# EAGLE design homie-wemos (EAGLE 7.5.0)
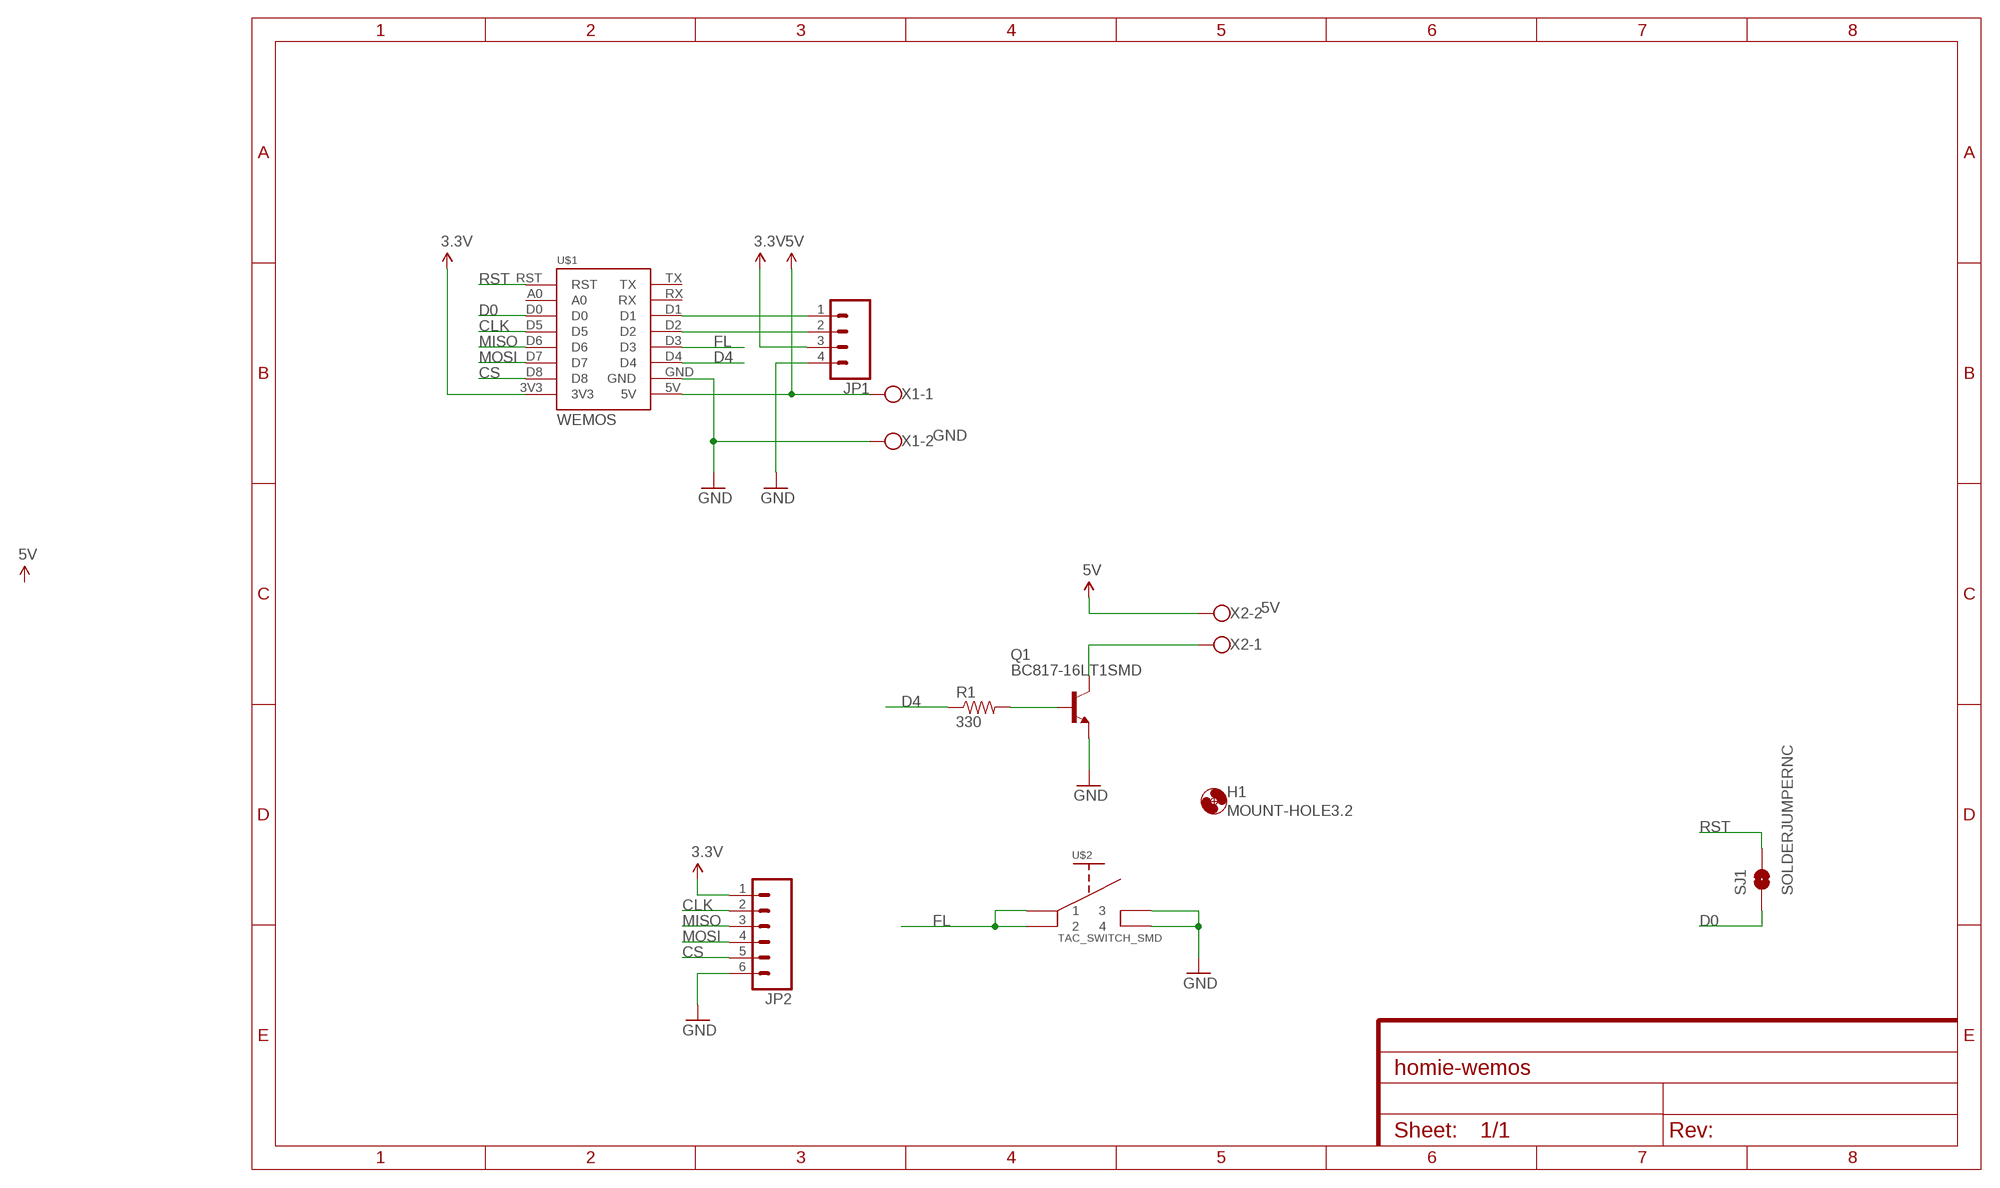
[diagram p0: schematic, sheet 1]

## Parts
H1  MOUNT-HOLE3.2  [3,2]
JP1  M04LOCK_LONGPADS  [1X04_LOCK_LONGPADS]
JP2  M06LOCK_LONGPADS  [1X06_LOCK_LONGPADS]
Q1  BC817-16LT1SMD  [SOT23-BEC]
R1  330  RESISTOR0603-RES  [0603-RES]
SJ1  SOLDERJUMPERNC  [SJ_2S]
U$1  WEMOS  [WEMOS]
U$2  TS-017A  [TS-017ASMD]
X1  W237-102  [W237-102]
X2  W237-102  [W237-102]

## Nets
3.3V: JP1.3 JP2.1 U$1.3V3
5V: U$1.5V X1.1 X2.2
CLK: JP2.2 U$1.D5
CS: JP2.5 U$1.D8
D0: SJ1.1 U$1.D0
D4: R1.1 U$1.D4
FL: U$1.D3 U$2.P$1 U$2.P$2
GND: JP1.4 JP2.6 Q1.E U$1.GND U$2.P$3 U$2.P$4 X1.2
MISO: JP2.3 U$1.D6
MOSI: JP2.4 U$1.D7
N$2: JP1.1 U$1.D1
N$3: JP1.2 U$1.D2
N$4: Q1.C X2.1
N$5: Q1.B R1.2
RST: SJ1.2 U$1.RST
Unconnected: U$1.A0 U$1.RX U$1.TX

## Notes on the sheet
- GND
- 5V

## Library data of the parts
H1 = holes:MOUNT-HOLE: MOUNTING HOLE with drill center marker
JP1 = SparkFun-Connectors:M04: Header 4 Standard 4-pin 0.1" header. Use with straight break away headers (SKU : PRT-00116), right angle break away headers (PRT-00553), swiss pins (PRT-00743), machine pins (PRT-00117), and female headers (PRT-00115). Molex polarized connector foot print use with SKU : PRT-08231 with associated crimp pins and housings. 1MM SMD Version SKU: PRT-10208
JP2 = SparkFun-Connectors:M06: Header 6 Standard 6-pin 0.1" header. Use with straight break away headers (SKU : PRT-00116), right angle break away headers (PRT-00553), swiss pins (PRT-00743), machine pins (PRT-00117), and female headers (PRT-00115). Molex polarized connector foot print use with SKU : PRT-08094 with associated crimp pins and housings. NOTES ON THE VARIANTS LOCK and LOCK_LONGPADS... This footprint was designed to help hold the alignment of a through-hole component (i.e. 6-pin header) while soldering it into place. You may notice that each hole has been shifted either up or down by 0.005 of an inch from it's more standard position (which is a perfectly straight line). This slight alteration caused the pins (the squares in the middle) to touch the edges of the holes. Because they are alternating, it causes a "brace" to hold the component in place. 0.005 has proven to be the perfect amount of "off-center" position when using our standard breakaway headers. Although looks a little odd when you look at the bare footprint, once you have a header in there, the alteration is very hard to notice. Also,if you push a header all the way into place, it is covered up entirely on the bottom side. This idea of altering the position of holes to aid alignment will be further integrated into the Sparkfun Library for other footprints. It can help hold any component with 3 or more connection pins.
Q1 = transistor-npn:BC817*: NPN Transistor
R1 = SparkFun-Passives:RESISTOR: Resistor Basic schematic elements and footprints for 0603, 1206, and PTH resistors.
SJ1 = SparkFun-Retired:SOLDERJUMPER: Solder Jumper Standard SMD solder jumper. Used to automate production. Two varients : Normally Open and Normally Closed are the same, but have different paste layers. NC will have a large amount of paste and should jumper during reflow.
U$1 = 1455413453956-wemos:WEMOS
U$2 = aliexpress-ts-017a:TS-017A
X1 X2 = con-wago-500:W237-102: WAGO SCREW CLAMP; MPN: 237-102; OC_FARNELL: unknown; OC_NEWARK: 70K9898

## Board
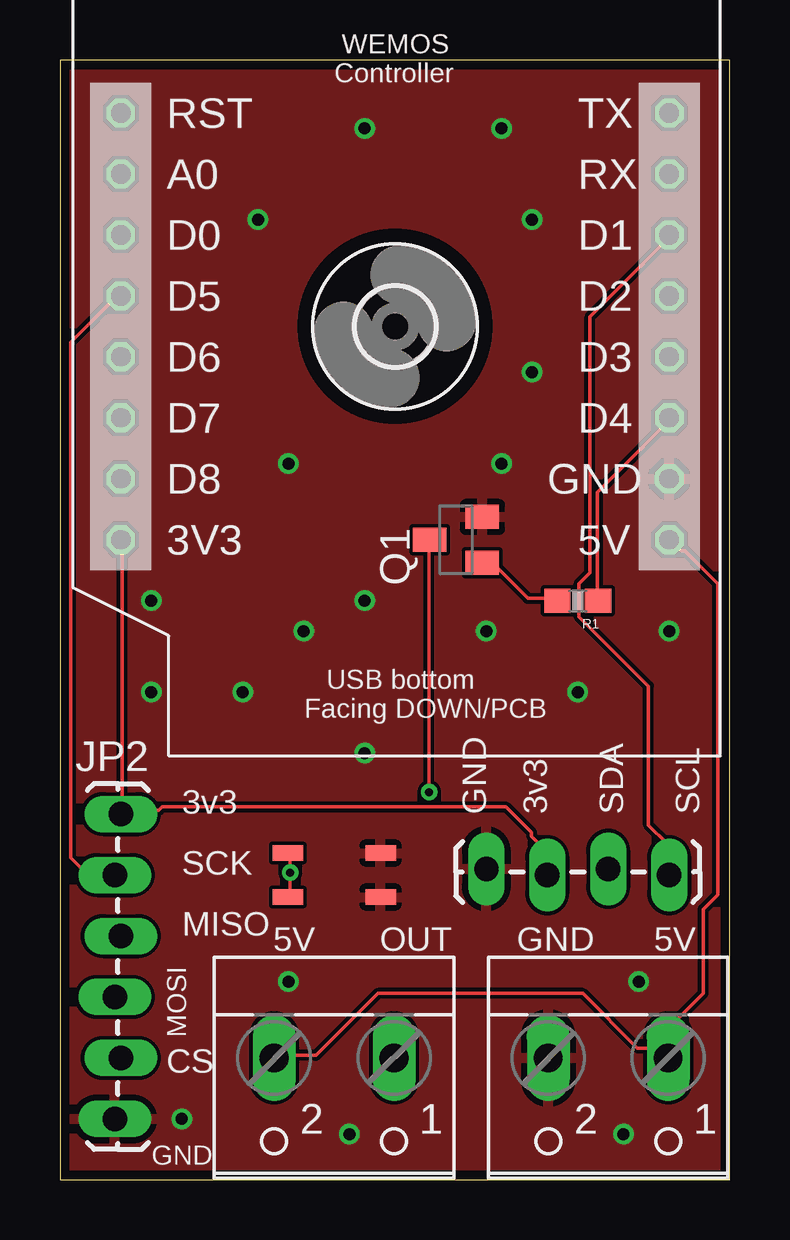
[diagram p1: board, top side]
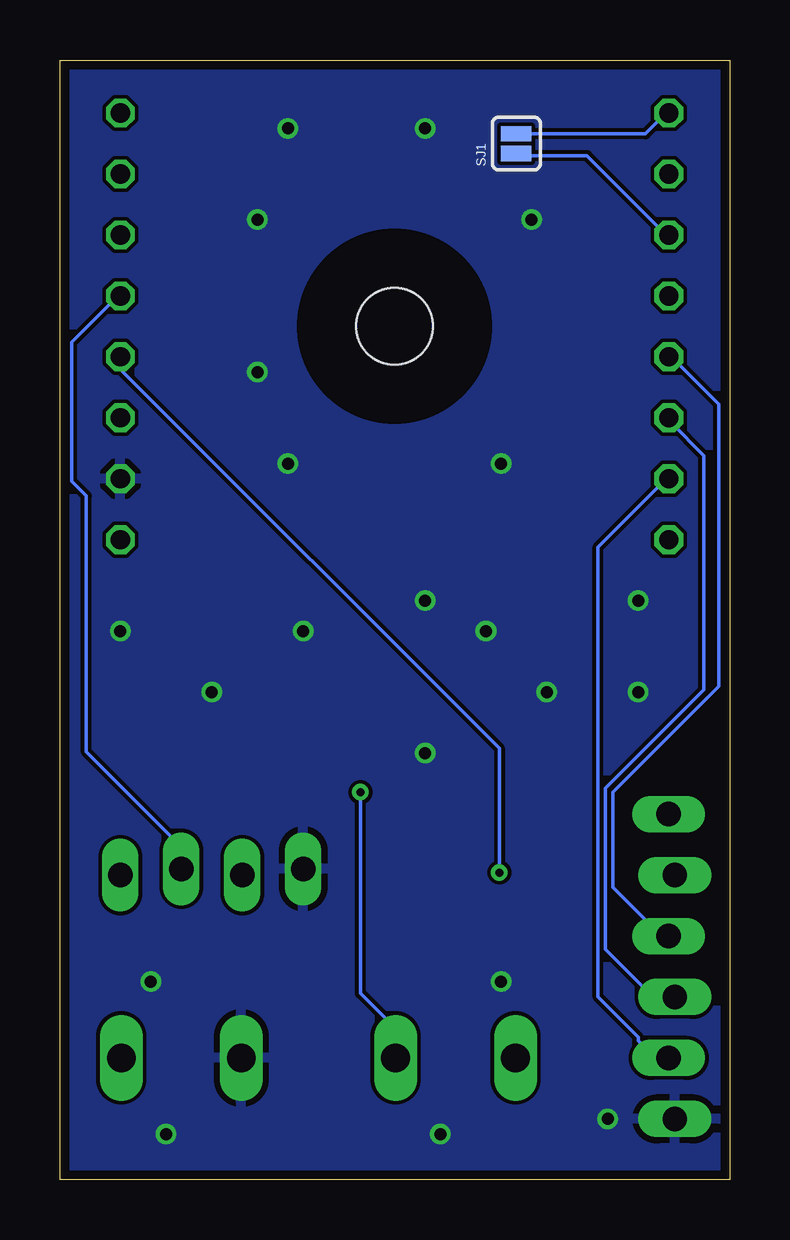
[diagram p2: board, bottom side, seen from below]

Size 27.92 x 46.66 mm. Coordinates in mm from the lower left corner, seen from the top.
Outline: 0,0 27.92,0 27.92,46.66 0,46.66 0,0
Copper layers (1*16): Top 0.0356mm / dielectric 1.5011mm / Bottom 0.0356mm
Design rules "OSHPark_LaenPCBOrder": minimum track width 6mil, minimum drill 13mil, track to track 6mil, track to pad 6mil, pad to pad 6mil, via to via 6mil, smd to smd 6mil, copper to edge 15mil, drill to drill 6mil, minimum pad ring 7mil, minimum via ring 7mil, stop-mask expansion 3mil, vias tented up to drill 0mil, thermal gap 10mil

### Footprints (pad centres in the part's own frame; a part is rotated, then mirrored left to right if it is on the bottom)
3,2 = hole 3.2: 0,0
1X04_LOCK_LONGPADS = drill 1.016 long: 1 0,0; 2 2.54,-0.254; 3 5.08,0; 4 7.62,-0.254
1X06_LOCK_LONGPADS = drill 1.016 long: 1 0,0; 2 2.54,-0.254; 3 5.08,0; 4 7.62,-0.254; 5 10.16,0; 6 12.7,-0.254
SOT23-BEC = smd 1 x 1.4: B -0.95,-1.1; C 0,1.1; E 0.95,-1.1
0603-RES = smd 1.1 x 1: 1 -0.85,0; 2 0.85,0
SJ_2S = smd 0.635 x 1.27: 1 -0.412,0; 2 0.412,0
WEMOS = drill 0.8 octagon: 3V3 0,0; 5V 22.86,0; A0 0,15.24; D0 0,12.7; D1 22.86,12.7; D2 22.86,10.16; D3 22.86,7.62; D4 22.86,5.08; D5 0,10.16; D6 0,7.62; D7 0,5.08; D8 0,2.54; GND 22.86,2.54; RST 0,17.78; RX 22.86,15.24; TX 22.86,17.78
TS-017ASMD = smd 1.27 x 0.635: P$1 -1.935,0.917; P$2 -1.935,-0.917; P$3 1.935,0.917; P$4 1.935,-0.917
W237-102 = drill 1.194 long: 1 -2.5,-1.27; 2 2.5,-1.27

### Placement (x,y rotation side)
H1  13.97,35.56 0 top
JP1  25.4,12.7 180 top
JP2  2.54,15.24 270 top
Q1  16.51,26.67 90 top
R1  21.59,24.13 180 top
SJ1  8.89,43.18 90 bottom
U$1  2.54,26.67 0 top
U$2  11.43,12.7 0 top
X1  22.86,3.81 180 top
X2  11.43,3.81 180 top

### Tracks (layer width: path | path; a pad name or v marks a point on that pad's centre or on a via)
3.3V
  Top 0.152: 2.59,15.39 2.59,15.24 JP2.1 2.59,15.39 | 2.59,15.39 2.59,26.67 U$1.3V3 | 2.59,15.39 4.12,15.39 4.27,15.54 18.59,15.54 19.66,14.48 19.66,14.33 20.27,13.72 20.27,12.8 JP1.3
5V
  Top 0.152: 25.45,5.49 25.45,5.18 X1.1 25.45,5.49 | 25.45,5.49 25.45,6.4 26.82,7.77 26.82,11.28 27.43,11.89 27.43,24.84 26.06,26.21 25.91,26.21 25.45,26.67 U$1.5V | 25.45,5.49 24.08,5.49 21.79,7.77 13.26,7.77 10.67,5.18 8.99,5.18 X2.2
CLK
  Top 0.152: U$1.D5 2.44,36.73 2.29,36.73 0.46,34.9 0.46,13.41 1.07,12.8 2.29,12.8 JP2.2
CS
  Bottom 0.152: U$1.D8 2.59,29.11 2.74,29.11 5.49,26.36 5.49,7.62 3.81,5.94 3.81,5.79 3.2,5.18 2.59,5.18 JP2.5
D0
  Bottom 0.152: SJ1.1 8.84,42.67 5.94,42.67 2.59,39.32 U$1.D0
D4
  Top 0.152: R1.1 22.4,24.23 22.4,28.65 25.45,31.7 U$1.D4
FL  (via drill 0.33)
  Top 0.152: U$2.P$2 9.6,11.89 v9.6,12.8 9.6,13.56 U$2.P$1
  Bottom 0.152: v9.6,12.8 9.6,17.98 25.3,33.68 25.3,34.29 U$1.D3
GND  (via drill 0.5 pad 0.25)
  other vias: 25.4,22.86 21.59,20.32 17.78,22.86 12.7,24.13 10.16,22.86 7.62,20.32 12.7,17.78 9.53,8.26 24.13,8.26 23.5,1.91 12.06,1.91 5.08,2.54 3.81,20.32 3.81,24.13 8.26,40.01 12.7,43.81 18.41,43.81 19.68,40.01 19.68,33.66 18.41,29.84 9.53,29.84
  pour Bottom: 0,46.99 0,0 27.94,0 27.94,46.99
  pour Top: 0,46.99 0,0 27.94,0 27.94,46.99
MISO
  Bottom 0.152: U$1.D6 2.44,34.29 0.46,32.31 0.46,20.57 4.88,16.15 4.88,12.19 2.9,10.21 2.59,10.21 JP2.3
MOSI
  Bottom 0.152: JP2.4 3.2,7.62 5.18,9.6 5.18,16.31 1.07,20.42 1.07,30.18 2.44,31.55 2.44,31.7 U$1.D7
N$2
  Top 0.152: U$1.D1 25.3,39.32 25.3,39.17 22.1,35.97 22.1,25.3 21.64,24.84 21.64,23.47 24.54,20.57 24.54,14.78 25.3,14.02 25.3,12.8 JP1.1
N$3
  Bottom 0.152: JP1.2 22.86,13.87 26.82,17.83 26.82,28.5 27.43,29.11 27.43,34.9 25.6,36.73 25.45,36.73 U$1.D2
N$4  (via drill 0.33)
  Top 0.152: v15.39,16.15 15.39,26.67 Q1.C
  Bottom 0.152: v15.39,16.15 15.39,7.77 14.02,6.4 14.02,5.18 X2.1
N$5
  Top 0.152: R1.2 20.73,24.23 19.51,24.23 18.14,25.6 17.68,25.6 Q1.B
RST
  Bottom 0.152: SJ1.2 8.84,43.59 3.5,43.59 2.59,44.5 U$1.RST

### Text on the board
tNames: 3v3 | GND | 3v3 | SDA | SCL | SCK | MISO | 5V | OUT | GND | 5V | MOSI | CS | GND